# Altium schematic sheet MOS Switch.SchDoc
size 297 x 209 mm; CompanyName: Sainsbury Wellcome Centre; Organization: FabLab; Address1: Sainsbury Wellcome Centre; Address2: 25 Howland Street; Address3: London; Address4: W1T 4JG; DocumentNumber: 10; SheetNumber: 10; SheetTotal: 14; swcgroup: FabLab; Org: Sainsbury Wellcome Centre; Add1: 25 Howland Street; Add2: London; Add3: W1T 4JG; WebAddress: www.sainsburywellcome.org; SheetSize: A4; SheetName: MOS Switch
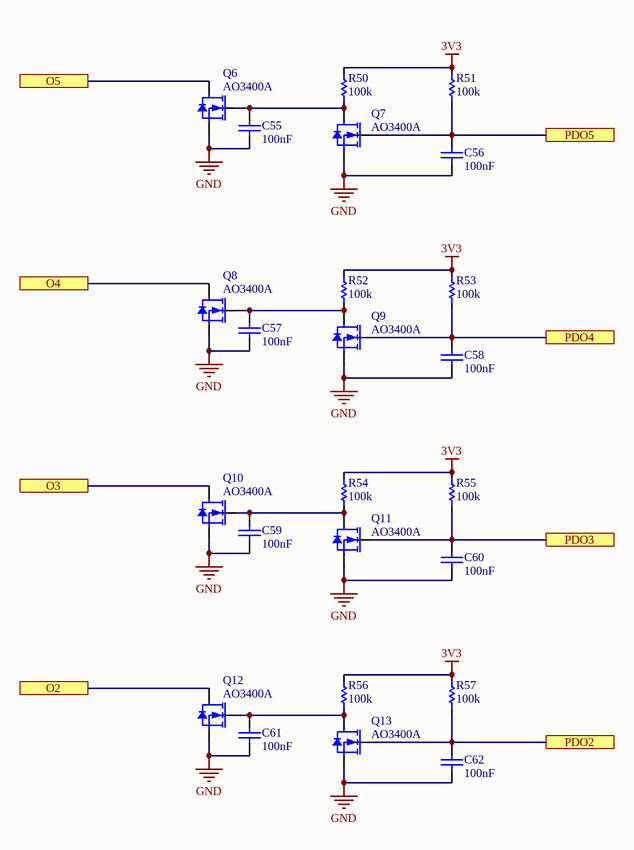
[diagram p0: MOS Switch.SchDoc]

## Parts
C55  value 100nF  [CAP_CHIP_0603]  (hidden comment: C0603-100nF-50V)
C56  value 100nF  [CAP_CHIP_0603]  (hidden comment: C0603-100nF-50V)
C57  value 100nF  [CAP_CHIP_0603]  (hidden comment: C0603-100nF-50V)
C58  value 100nF  [CAP_CHIP_0603]  (hidden comment: C0603-100nF-50V)
C59  value 100nF  [CAP_CHIP_0603]  (hidden comment: C0603-100nF-50V)
C60  value 100nF  [CAP_CHIP_0603]  (hidden comment: C0603-100nF-50V)
C61  value 100nF  [CAP_CHIP_0603]  (hidden comment: C0603-100nF-50V)
C62  value 100nF  [CAP_CHIP_0603]  (hidden comment: C0603-100nF-50V)
Q6  AO3400A  [SOT23]
Q7  AO3400A  [SOT23]
Q8  AO3400A  [SOT23]
Q9  AO3400A  [SOT23]
Q10  AO3400A  [SOT23]
Q11  AO3400A  [SOT23]
Q12  AO3400A  [SOT23]
Q13  AO3400A  [SOT23]
R50  value 100k  [RES_CHIP_0603]  (hidden comment: R0603-100K)
R51  value 100k  [RES_CHIP_0603]  (hidden comment: R0603-100K)
R52  value 100k  [RES_CHIP_0603]  (hidden comment: R0603-100K)
R53  value 100k  [RES_CHIP_0603]  (hidden comment: R0603-100K)
R54  value 100k  [RES_CHIP_0603]  (hidden comment: R0603-100K)
R55  value 100k  [RES_CHIP_0603]  (hidden comment: R0603-100K)
R56  value 100k  [RES_CHIP_0603]  (hidden comment: R0603-100K)
R57  value 100k  [RES_CHIP_0603]  (hidden comment: R0603-100K)

## Ports
O2, O3, O4, O5, PDO2, PDO3, PDO4, PDO5

## Nets
3V3: R50.2 R51.2 R52.2 R53.2 R54.2 R55.2 R56.2 R57.2
GND: C55.1 C56.1 C57.1 C58.1 C59.1 C60.1 C61.1 C62.1 Q6.2(S) Q7.2(S) Q8.2(S) Q9.2(S) Q10.2(S) Q11.2(S) Q12.2(S) Q13.2(S)
O2: Q12.3(D) ; port O2
O3: Q10.3(D) ; port O3
O4: Q8.3(D) ; port O4
O5: Q6.3(D) ; port O5
PDO2: C62.2 Q13.1(G) R57.1 ; port PDO2
PDO3: C60.2 Q11.1(G) R55.1 ; port PDO3
PDO4: C58.2 Q9.1(G) R53.1 ; port PDO4
PDO5: C56.2 Q7.1(G) R51.1 ; port PDO5
NetC55_2: C55.2 Q6.1(G) Q7.3(D) R50.1
NetC57_2: C57.2 Q8.1(G) Q9.3(D) R52.1
NetC59_2: C59.2 Q10.1(G) Q11.3(D) R54.1
NetC61_2: C61.2 Q12.1(G) Q13.3(D) R56.1

## Notes on the sheet
- FILE
- VARIANT
- DATE
- REVISION
- SHEET
- /
- PROJECT
- SIZE

## Library data of the parts
C55-C62 = CMP-611-0027-24: 0603 Multilayer Ceramic Capacitors MLCC; PartNumber: CC0603KRX7R9BB104; Pick&PlaceFootprint: C0603; Dielectric: X7R; Voltage Rating: 50V; Tolerance: 10%; Case/Package: 0603; Capacitor Type: Ceramic; LCSC Part N.: C14663; Mount: SMD; RoHS: Yes
Q6-Q13 = CMP-810-0002-2: 30V 5.7A 26.5mΩ@10V,5.7A 1.4W 1.5V@250uA 1 NChannel SOT-23-3L MOSFETs; Gate-Source Voltage (Vgs): 12V; Pick&PlaceFootprint: SOT-23; RDS(ON): 26.5mR; Switching Time: 34.5ns; LCSC Part N.: C20917; Drain-Source Voltage (Vds): 30V; Mount: Surface Mount; PartNumber: AO3400A; Power Dissipation: 1.4W; Drain Current (Id): 5.7A; Polarity: N Channel
R50-R57 = CMP-633-0000-28: 100mW Thick Film Resistors 75V ±100ppm/℃ ±1% 0603 Chip Resistor; PartNumber: 0603WAF1003T5E; Number of Resistors: 1; Pick&PlaceFootprint: R0603; LCSC Part N.: C25803; Mount: Surface Mount; Voltage Rating: 75V; Power Rating: 100mW; Case/Package: 0603; Tolerance: 1%